# Altium project SPW-SPAI-ANODE-002D-SCH-FM.PrjPcb (part 3 of 3)

## Sheet PAGE12.SchDoc
size 246 x 182 mm
Used 11 times, as channels Array/CFD26, Array/CFD24, Array/CFD22, Array/CFD20, Array/CFD18, Array/CFD16, Array/CFD14, Array/CFD12, Array/CFD27, Array/CFD25, Array/CFD23. Parts and nets are listed once, with the designators drawn on the sheet.
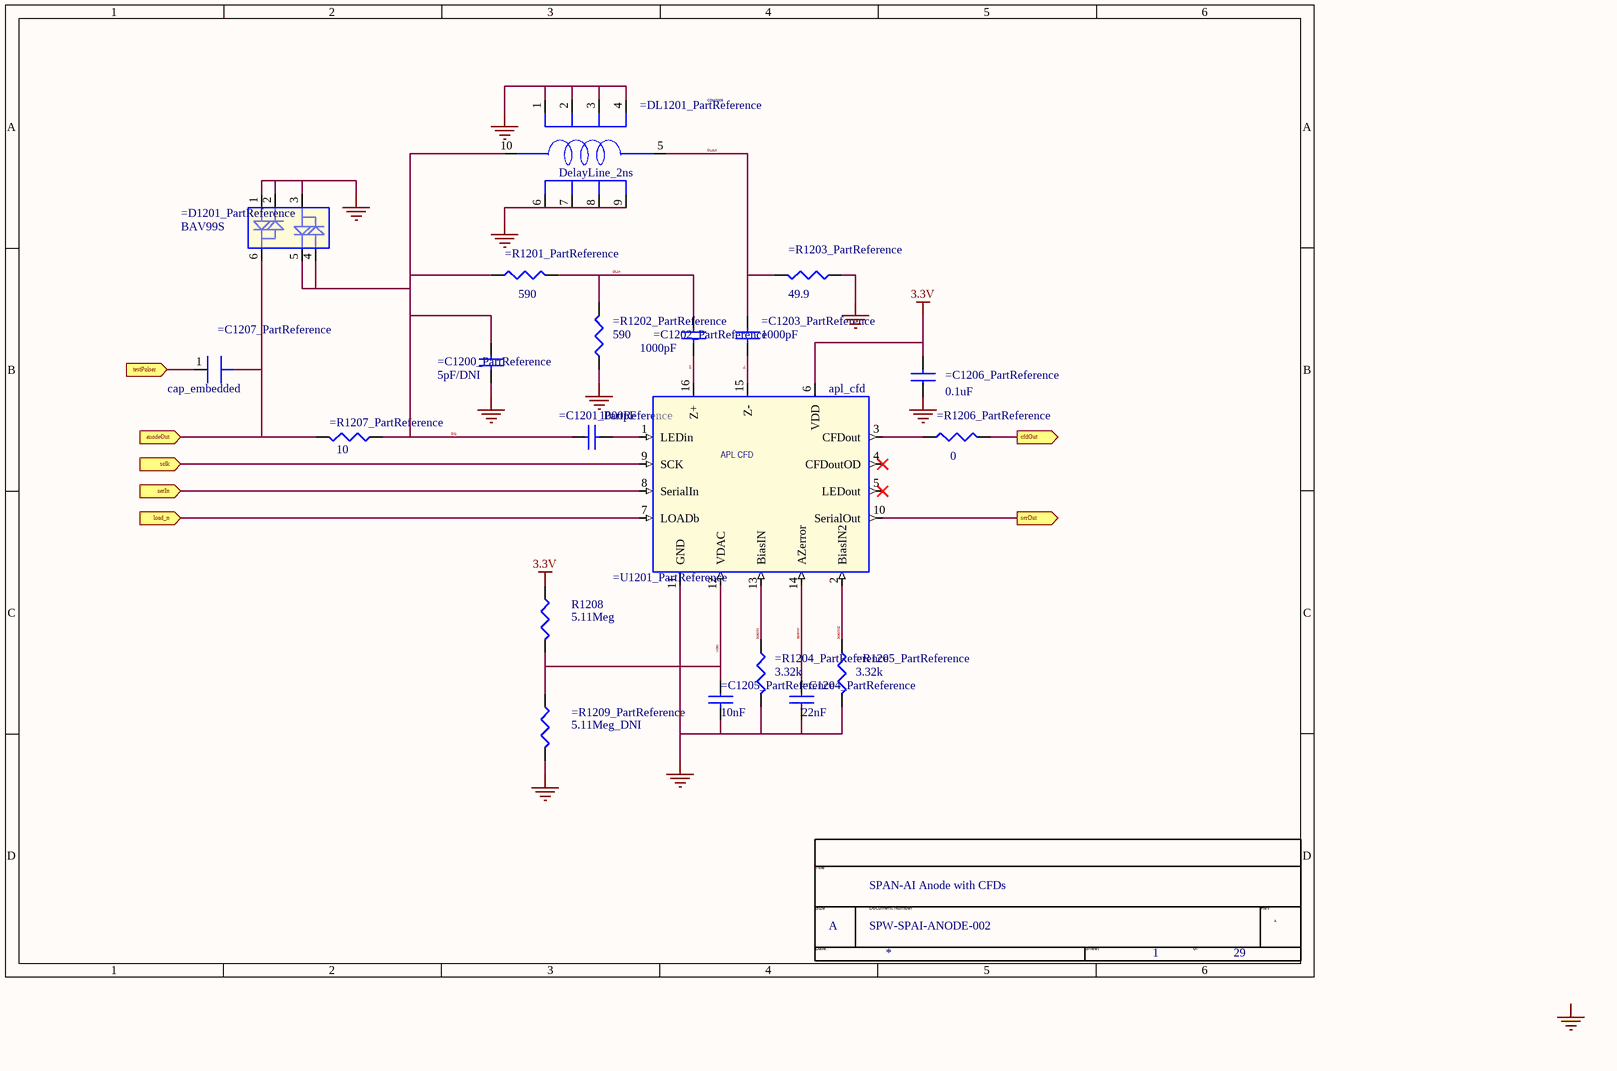
[diagram p15: PAGE12.SchDoc]

### Parts
*  Page Count: 29  Page Number: 1  Page Size: A  Title: SPAN-AI Anode with CFDs  Doc: SPW-SPAI-ANODE-002  (hidden comment: TitleBlock0)  (graphical)
=C1200_PartReference  5pF/DNI  [0402]
=C1201_PartReference  1000pF  [0402]
=C1202_PartReference  1000pF  [0402]
=C1203_PartReference  1000pF  [0402]
=C1204_PartReference  22nF  [0603]
=C1205_PartReference  10nF  [0603]
=C1206_PartReference  0.1uF  [0805]
=C1207_PartReference  cap_embedded  [cap_emb]
=D1201_PartReference  BAV99S  [sot23]
=DL1201_PartReference  DelayLine_2ns  PartNumber: CDM2005  [CDM10]
=R1201_PartReference  590  [0402]
=R1202_PartReference  590  [0402]
=R1203_PartReference  49.9  [0402]
=R1204_PartReference  3.32k  [0402]
=R1205_PartReference  3.32k  [0402]
=R1206_PartReference  0  [0402]
=R1207_PartReference  10  [0402]
=R1209_PartReference  5.11Meg_DNI  [0402]
=U1201_PartReference  apl_cfd  [lcc16]
R1208  5.11Meg  [0402]

### Ports
anodeOut (in), cfdOut (out), load_n (in), sclk (in), serIn (in), serOut (out), testPulser (in)

### Nets
3.3V: =C1206_PartReference.2 =U1201_PartReference.6(VDD) R1208.1
GND: =C1200_PartReference.2 =C1204_PartReference.2 =C1205_PartReference.2 =C1206_PartReference.1 =D1201_PartReference.1 =D1201_PartReference.2 =D1201_PartReference.3 =DL1201_PartReference.1(GND1) =DL1201_PartReference.2(GND2) =DL1201_PartReference.3(GND3) =DL1201_PartReference.4(GND4) =DL1201_PartReference.6(GND5) =DL1201_PartReference.7(GND6) =DL1201_PartReference.8(GND7) =DL1201_PartReference.9(GND8) =R1202_PartReference.1 =R1203_PartReference.1 =R1204_PartReference.2 =R1205_PartReference.2 =R1209_PartReference.2 =U1201_PartReference.11(GND)
anodeOut: =D1201_PartReference.6 =R1207_PartReference.2 ; port anodeOut
azerror: =C1204_PartReference.1 =U1201_PartReference.14(AZerror)
biasIN: =R1204_PartReference.1 =U1201_PartReference.13(BiasIN)
biasIN2: =R1205_PartReference.1 =U1201_PartReference.2(BiasIN2)
cfdOut: =R1206_PartReference.2 ; port cfdOut
DLin: =C1202_PartReference.1 =R1201_PartReference.2 =R1202_PartReference.2
DLout: =C1203_PartReference.1 =DL1201_PartReference.5(OUT) =R1203_PartReference.2
load_n: =U1201_PartReference.7(LOADb) ; port load_n
sclk: =U1201_PartReference.9(SCK) ; port sclk
serIn: =U1201_PartReference.8(SerialIn) ; port serIn
serOut: =U1201_PartReference.10(SerialOut) ; port serOut
Sig: =C1200_PartReference.1 =C1201_PartReference.1 =D1201_PartReference.4 =D1201_PartReference.5 =DL1201_PartReference.10(IN) =R1201_PartReference.1 =R1207_PartReference.1
testPulser: =C1207_PartReference.1 ; port testPulser
vdac: =C1205_PartReference.1 =R1209_PartReference.1 =U1201_PartReference.12(VDAC) R1208.2
z+: =C1202_PartReference.2 =U1201_PartReference.16(Z+)
z-: =C1203_PartReference.2 =U1201_PartReference.15(Z-)
Net=C1201_PartReference_2: =C1201_PartReference.2 =U1201_PartReference.1(LEDin)
Net=R1206_PartReference_1: =R1206_PartReference.1 =U1201_PartReference.3(CFDout)

Not connected (* = marked no-connect by the designer): =U1201_PartReference 4(CFDoutOD)* 5(LEDout)*

### Channels
Array/CFD26: designators end in _CFD26; ports anodeOut=anode26 cfdOut=stop14 load_n=load_n10 sclk=sclk6 serIn=serOut9 serOut=serOut26 testPulser=tp_stop2
Array/CFD24: designators end in _CFD24; ports anodeOut=anode24 cfdOut=stop12 load_n=load_n8 sclk=sclk5 serIn=serOut7 serOut=serOut24 testPulser=tp_stop1
Array/CFD22: designators end in _CFD22; ports anodeOut=anode22 cfdOut=stop10 load_n=load_n6 sclk=sclk4 serIn=serOut5 serOut=serOut22 testPulser=tp_stop3
Array/CFD20: designators end in _CFD20; ports anodeOut=anode20 cfdOut=stop8 load_n=load_n5 sclk=sclk3 serIn=serOut21 serOut=serOut20 testPulser=tp_stop1
Array/CFD18: designators end in _CFD18; ports anodeOut=anode18 cfdOut=stop6 load_n=load_n4 sclk=sclk2 serIn=serOut19 serOut=serOut18 testPulser=tp_stop3
Array/CFD16: designators end in _CFD16; ports anodeOut=anode16 cfdOut=stop4 load_n=load_n3 sclk=sclk2 serIn=serOut17 serOut=serOut16 testPulser=tp_stop1
Array/CFD14: designators end in _CFD14; ports anodeOut=anode14 cfdOut=stop2 load_n=load_n2 sclk=sclk1 serIn=serOut15 serOut=serOut14 testPulser=tp_stop3
Array/CFD12: designators end in _CFD12; ports anodeOut=anode12 cfdOut=stop0 load_n=load_n1 sclk=sclk1 serIn=serOut13 serOut=serOut12 testPulser=tp_stop1
Array/CFD27: designators end in _CFD27; ports anodeOut=anode27 cfdOut=stop15 load_n=load_n11 sclk=sclk6 serIn=serOut10 serOut=serOut27 testPulser=tp_stop4
Array/CFD25: designators end in _CFD25; ports anodeOut=anode25 cfdOut=stop13 load_n=load_n9 sclk=sclk5 serIn=serOut8 serOut=serOut25 testPulser=tp_stop3
Array/CFD23: designators end in _CFD23; ports anodeOut=anode23 cfdOut=stop11 load_n=load_n7 sclk=sclk4 serIn=serOut6 serOut=serOut23 testPulser=tp_stop4

### Notes on the sheet
- Labels drawn without touching a wire or pin: GND
- (in symbol apl_cfd_1) APL CFD
- (in symbol TitleBlock0) Title; Size; Document Number; Rev; Date:; Sheet; of

### Library data of the parts
=C1200_PartReference = CAP NP_Dup2: PartNumber: SR0402NPO5R0B3; PCB Footprint: 0402
=C1201_PartReference =C1202_PartReference =C1203_PartReference = CAP NP_Dup2: PartNumber: SR0402NPO102B3; PCB Footprint: 0402
=C1204_PartReference = CAP NP_Dup2: PartNumber: SR0603X7R223K2NT95#M123; PCB Footprint: 0603
=C1205_PartReference = CAP NP_Dup2: PartNumber: SR0603X7R103K2NT95#M123; PCB Footprint: 0603
=C1206_PartReference = CAP NP_Dup2: PartNumber: SR0805X7R104K2NT95#M123; PCB Footprint: 0805
=D1201_PartReference = dual_diode_0: PartNumber: BAV99S; PCB Footprint: BAV99S
=DL1201_PartReference = DelayLine_1: PCB Footprint: CDM2005
=R1201_PartReference =R1202_PartReference = R_Dup1: PartNumber: M55342H11B590DR; PCB Footprint: 0402
=R1203_PartReference = R_Dup1: PartNumber: M55342H11B49D9R; PCB Footprint: 0402
=R1204_PartReference =R1205_PartReference = R_Dup1: PartNumber: M55342H11B3E32R; PCB Footprint: 0402
=R1206_PartReference = R_Dup1: PCB Footprint: 0402
=R1207_PartReference = R_Dup1: PartNumber: M55342H11B10D0R; PCB Footprint: 0402
=R1209_PartReference R1208 = R: Pin Numbers Visible: True; Pin Names Visible: False; EDIForiginalOrigin: (pt 0 0); EDIFviewName: NORMAL; PCB Footprint: 0402
=U1201_PartReference = apl_cfd_1: PCB Footprint: apl_cfd
* = TitleBlock0: RevCode: A; Page Create Date: March  8, 1995; Page Modify Date: *; Page_Number: =TitleBlock_1_Page_Number
=C1207_PartReference = cap_embedded: PCB Footprint: cap_emb

## Nets that join several sheets
3.3V: PAGE1 (27 pins), Array/CFD17 (C1306_CFD17.2 R1308_CFD17.1 U1301_CFD17.6), Array/CFD3 (=C106_PartReference_CFD3.2 =R108_PartReference_CFD3.1 =U101_PartReference_CFD3.6), Array/CFD15 (C1306_CFD15.2 R1308_CFD15.1 U1301_CFD15.6), Array/CFD13 (C1306_CFD13.2 R1308_CFD13.1 U1301_CFD13.6), Array/CFD11 (=C106_PartReference_CFD11.2 =R108_PartReference_CFD11.1 =U101_PartReference_CFD11.6), Array/CFD1 (=C106_PartReference_CFD1.2 =R108_PartReference_CFD1.1 =U101_PartReference_CFD1.6), Array/CFD9 (=C106_PartReference_CFD9.2 =R108_PartReference_CFD9.1 =U101_PartReference_CFD9.6), Array/CFD26 (=C1206_PartReference_CFD26.2 =U1201_PartReference_CFD26.6 R1208_CFD26.1), Array/CFD24 (=C1206_PartReference_CFD24.2 =U1201_PartReference_CFD24.6 R1208_CFD24.1), Array/CFD7 (=C106_PartReference_CFD7.2 =R108_PartReference_CFD7.1 =U101_PartReference_CFD7.6), Array/CFD22 (=C1206_PartReference_CFD22.2 =U1201_PartReference_CFD22.6 R1208_CFD22.1), Array/CFD5 (=C106_PartReference_CFD5.2 =R108_PartReference_CFD5.1 =U101_PartReference_CFD5.6), Array/CFD20 (=C1206_PartReference_CFD20.2 =U1201_PartReference_CFD20.6 R1208_CFD20.1), Array/CFD18 (=C1206_PartReference_CFD18.2 =U1201_PartReference_CFD18.6 R1208_CFD18.1), Array/CFD16 (=C1206_PartReference_CFD16.2 =U1201_PartReference_CFD16.6 R1208_CFD16.1), Array/CFD14 (=C1206_PartReference_CFD14.2 =U1201_PartReference_CFD14.6 R1208_CFD14.1), Array/CFD12 (=C1206_PartReference_CFD12.2 =U1201_PartReference_CFD12.6 R1208_CFD12.1), Array/CFD10 (=C106_PartReference_CFD10.2 =R108_PartReference_CFD10.1 =U101_PartReference_CFD10.6), Array/CFD2 (=C106_PartReference_CFD2.2 =R108_PartReference_CFD2.1 =U101_PartReference_CFD2.6), Array/CFD27 (=C1206_PartReference_CFD27.2 =U1201_PartReference_CFD27.6 R1208_CFD27.1), Array/CFD25 (=C1206_PartReference_CFD25.2 =U1201_PartReference_CFD25.6 R1208_CFD25.1), Array/CFD8 (=C106_PartReference_CFD8.2 =R108_PartReference_CFD8.1 =U101_PartReference_CFD8.6), Array/CFD23 (=C1206_PartReference_CFD23.2 =U1201_PartReference_CFD23.6 R1208_CFD23.1), Array/CFD6 (=C106_PartReference_CFD6.2 =R108_PartReference_CFD6.1 =U101_PartReference_CFD6.6), Array/CFD21 (C1306_CFD21.2 R1308_CFD21.1 U1301_CFD21.6), Array/CFD4 (=C106_PartReference_CFD4.2 =R108_PartReference_CFD4.1 =U101_PartReference_CFD4.6), Array/CFD19 (C1306_CFD19.2 R1308_CFD19.1 U1301_CFD19.6)
GND: PAGE1 (49 pins), Array/CFD17 (21 pins), Array/CFD3 (21 pins), Array/CFD15 (21 pins), Array/CFD13 (21 pins), Array/CFD11 (21 pins), Array/CFD1 (21 pins), Array/CFD9 (21 pins), Array/CFD26 (21 pins), Array/CFD24 (21 pins), Array/CFD7 (21 pins), Array/CFD22 (21 pins), Array/CFD5 (21 pins), Array/CFD20 (21 pins), Array/CFD18 (21 pins), Array/CFD16 (21 pins), Array/CFD14 (21 pins), Array/CFD12 (21 pins), Array/CFD10 (21 pins), Array/CFD2 (21 pins), Array/CFD27 (21 pins), Array/CFD25 (21 pins), Array/CFD8 (21 pins), Array/CFD23 (21 pins), Array/CFD6 (21 pins), Array/CFD21 (21 pins), Array/CFD4 (21 pins), Array/CFD19 (21 pins)
anode1: PAGE14 (A1.1), Array/CFD1 (=D101_PartReference_CFD1.3 =R107_PartReference_CFD1.2)
anode2: PAGE14 (A2.1), Array/CFD2 (=D101_PartReference_CFD2.3 =R107_PartReference_CFD2.2)
anode3: PAGE14 (A3.1), Array/CFD3 (=D101_PartReference_CFD3.3 =R107_PartReference_CFD3.2)
anode4: PAGE14 (A4.1), Array/CFD4 (=D101_PartReference_CFD4.3 =R107_PartReference_CFD4.2)
anode5: PAGE14 (A5.1), Array/CFD5 (=D101_PartReference_CFD5.3 =R107_PartReference_CFD5.2)
anode6: PAGE14 (A6.1), Array/CFD6 (=D101_PartReference_CFD6.3 =R107_PartReference_CFD6.2)
anode7: PAGE14 (A7.1), Array/CFD7 (=D101_PartReference_CFD7.3 =R107_PartReference_CFD7.2)
anode8: PAGE14 (A8.1), Array/CFD8 (=D101_PartReference_CFD8.3 =R107_PartReference_CFD8.2)
anode9: PAGE14 (A9.1), Array/CFD9 (=D101_PartReference_CFD9.3 =R107_PartReference_CFD9.2)
anode10: PAGE14 (A10.1), Array/CFD10 (=D101_PartReference_CFD10.3 =R107_PartReference_CFD10.2)
anode11: PAGE14 (A11.1), Array/CFD11 (=D101_PartReference_CFD11.3 =R107_PartReference_CFD11.2)
anode12: PAGE14 (A12.1), Array/CFD12 (=D1201_PartReference_CFD12.6 =R1207_PartReference_CFD12.2)
anode13: PAGE14 (A13.1), Array/CFD13 (=D1301_PartReference_CFD13.4 =D1301_PartReference_CFD13.5 =R1307_PartReference_CFD13.2)
anode14: PAGE14 (A14.1), Array/CFD14 (=D1201_PartReference_CFD14.6 =R1207_PartReference_CFD14.2)
anode15: PAGE14 (A15.1), Array/CFD15 (=D1301_PartReference_CFD15.4 =D1301_PartReference_CFD15.5 =R1307_PartReference_CFD15.2)
anode16: PAGE14 (A16.1), Array/CFD16 (=D1201_PartReference_CFD16.6 =R1207_PartReference_CFD16.2)
anode17: PAGE14 (A17.1), Array/CFD17 (=D1301_PartReference_CFD17.4 =D1301_PartReference_CFD17.5 =R1307_PartReference_CFD17.2)
anode18: PAGE14 (A18.1), Array/CFD18 (=D1201_PartReference_CFD18.6 =R1207_PartReference_CFD18.2)
anode19: PAGE14 (A19.1), Array/CFD19 (=D1301_PartReference_CFD19.4 =D1301_PartReference_CFD19.5 =R1307_PartReference_CFD19.2)
anode20: PAGE14 (A20.1), Array/CFD20 (=D1201_PartReference_CFD20.6 =R1207_PartReference_CFD20.2)
anode21: PAGE14 (A21.1), Array/CFD21 (=D1301_PartReference_CFD21.4 =D1301_PartReference_CFD21.5 =R1307_PartReference_CFD21.2)
anode22: PAGE14 (A22.1), Array/CFD22 (=D1201_PartReference_CFD22.6 =R1207_PartReference_CFD22.2)
anode23: PAGE14 (A23.1), Array/CFD23 (=D1201_PartReference_CFD23.6 =R1207_PartReference_CFD23.2)
anode24: PAGE14 (A24.1), Array/CFD24 (=D1201_PartReference_CFD24.6 =R1207_PartReference_CFD24.2)
anode25: PAGE14 (A25.1), Array/CFD25 (=D1201_PartReference_CFD25.6 =R1207_PartReference_CFD25.2)
anode26: PAGE14 (A26.1), Array/CFD26 (=D1201_PartReference_CFD26.6 =R1207_PartReference_CFD26.2)
anode27: PAGE14 (A27.1), Array/CFD27 (=D1201_PartReference_CFD27.6 =R1207_PartReference_CFD27.2)
load_n1: Array/CFD13 (U1301_CFD13.7), Array/CFD1 (=U101_PartReference_CFD1.7), Array/CFD12 (=U1201_PartReference_CFD12.7)
load_n2: Array/CFD15 (U1301_CFD15.7), Array/CFD14 (=U1201_PartReference_CFD14.7), Array/CFD2 (=U101_PartReference_CFD2.7)
load_n3: Array/CFD17 (U1301_CFD17.7), Array/CFD3 (=U101_PartReference_CFD3.7), Array/CFD16 (=U1201_PartReference_CFD16.7)
load_n4: Array/CFD18 (=U1201_PartReference_CFD18.7), Array/CFD4 (=U101_PartReference_CFD4.7), Array/CFD19 (U1301_CFD19.7)
load_n5: Array/CFD5 (=U101_PartReference_CFD5.7), Array/CFD20 (=U1201_PartReference_CFD20.7), Array/CFD21 (U1301_CFD21.7)
load_n6: Array/CFD22 (=U1201_PartReference_CFD22.7), Array/CFD6 (=U101_PartReference_CFD6.7)
load_n7: Array/CFD7 (=U101_PartReference_CFD7.7), Array/CFD23 (=U1201_PartReference_CFD23.7)
load_n8: Array/CFD24 (=U1201_PartReference_CFD24.7), Array/CFD8 (=U101_PartReference_CFD8.7)
load_n9: Array/CFD9 (=U101_PartReference_CFD9.7), Array/CFD25 (=U1201_PartReference_CFD25.7)
load_n10: Array/CFD26 (=U1201_PartReference_CFD26.7), Array/CFD10 (=U101_PartReference_CFD10.7)
load_n11: Array/CFD11 (=U101_PartReference_CFD11.7), Array/CFD27 (=U1201_PartReference_CFD27.7)
sclk1: Array/CFD15 (U1301_CFD15.9), Array/CFD13 (U1301_CFD13.9), Array/CFD1 (=U101_PartReference_CFD1.9), Array/CFD14 (=U1201_PartReference_CFD14.9), Array/CFD12 (=U1201_PartReference_CFD12.9), Array/CFD2 (=U101_PartReference_CFD2.9)
sclk2: Array/CFD17 (U1301_CFD17.9), Array/CFD3 (=U101_PartReference_CFD3.9), Array/CFD18 (=U1201_PartReference_CFD18.9), Array/CFD16 (=U1201_PartReference_CFD16.9), Array/CFD4 (=U101_PartReference_CFD4.9), Array/CFD19 (U1301_CFD19.9)
sclk3: Array/CFD5 (=U101_PartReference_CFD5.9), Array/CFD20 (=U1201_PartReference_CFD20.9), Array/CFD21 (U1301_CFD21.9)
sclk4: Array/CFD7 (=U101_PartReference_CFD7.9), Array/CFD22 (=U1201_PartReference_CFD22.9), Array/CFD23 (=U1201_PartReference_CFD23.9), Array/CFD6 (=U101_PartReference_CFD6.9)
sclk5: Array/CFD9 (=U101_PartReference_CFD9.9), Array/CFD24 (=U1201_PartReference_CFD24.9), Array/CFD25 (=U1201_PartReference_CFD25.9), Array/CFD8 (=U101_PartReference_CFD8.9)
sclk6: Array/CFD11 (=U101_PartReference_CFD11.9), Array/CFD26 (=U1201_PartReference_CFD26.9), Array/CFD10 (=U101_PartReference_CFD10.9), Array/CFD27 (=U1201_PartReference_CFD27.9)
serOut1: Array/CFD15 (U1301_CFD15.8), Array/CFD1 (=U101_PartReference_CFD1.10)
serOut2: Array/CFD17 (U1301_CFD17.8), Array/CFD2 (=U101_PartReference_CFD2.10)
serOut3: Array/CFD3 (=U101_PartReference_CFD3.10), Array/CFD19 (U1301_CFD19.8)
serOut4: Array/CFD21 (U1301_CFD21.8), Array/CFD4 (=U101_PartReference_CFD4.10)
serOut5: Array/CFD22 (=U1201_PartReference_CFD22.8), Array/CFD5 (=U101_PartReference_CFD5.10)
serOut6: Array/CFD23 (=U1201_PartReference_CFD23.8), Array/CFD6 (=U101_PartReference_CFD6.10)
serOut7: Array/CFD24 (=U1201_PartReference_CFD24.8), Array/CFD7 (=U101_PartReference_CFD7.10)
serOut8: Array/CFD25 (=U1201_PartReference_CFD25.8), Array/CFD8 (=U101_PartReference_CFD8.10)
serOut9: Array/CFD9 (=U101_PartReference_CFD9.10), Array/CFD26 (=U1201_PartReference_CFD26.8)
serOut10: Array/CFD10 (=U101_PartReference_CFD10.10), Array/CFD27 (=U1201_PartReference_CFD27.8)
serOut11: PAGE1 (J1.43), Array/CFD11 (=U101_PartReference_CFD11.10)
serOut12: Array/CFD1 (=U101_PartReference_CFD1.8), Array/CFD12 (=U1201_PartReference_CFD12.10)
serOut13: Array/CFD13 (U1301_CFD13.10), Array/CFD12 (=U1201_PartReference_CFD12.8)
serOut14: Array/CFD14 (=U1201_PartReference_CFD14.10), Array/CFD2 (=U101_PartReference_CFD2.8)
serOut15: Array/CFD15 (U1301_CFD15.10), Array/CFD14 (=U1201_PartReference_CFD14.8)
serOut16: Array/CFD3 (=U101_PartReference_CFD3.8), Array/CFD16 (=U1201_PartReference_CFD16.10)
serOut17: Array/CFD17 (U1301_CFD17.10), Array/CFD16 (=U1201_PartReference_CFD16.8)
serOut18: Array/CFD18 (=U1201_PartReference_CFD18.10), Array/CFD4 (=U101_PartReference_CFD4.8)
serOut19: Array/CFD18 (=U1201_PartReference_CFD18.8), Array/CFD19 (U1301_CFD19.10)
serOut20: Array/CFD5 (=U101_PartReference_CFD5.8), Array/CFD20 (=U1201_PartReference_CFD20.10)
serOut21: Array/CFD20 (=U1201_PartReference_CFD20.8), Array/CFD21 (U1301_CFD21.10)
serOut22: Array/CFD22 (=U1201_PartReference_CFD22.10), Array/CFD6 (=U101_PartReference_CFD6.8)
serOut23: Array/CFD7 (=U101_PartReference_CFD7.8), Array/CFD23 (=U1201_PartReference_CFD23.10)
serOut24: Array/CFD24 (=U1201_PartReference_CFD24.10), Array/CFD8 (=U101_PartReference_CFD8.8)
serOut25: Array/CFD9 (=U101_PartReference_CFD9.8), Array/CFD25 (=U1201_PartReference_CFD25.10)
serOut26: Array/CFD26 (=U1201_PartReference_CFD26.10), Array/CFD10 (=U101_PartReference_CFD10.8)
serOut27: Array/CFD11 (=U101_PartReference_CFD11.8), Array/CFD27 (=U1201_PartReference_CFD27.10)
start0: PAGE1 (J1.3), Array/CFD1 (=R106_PartReference_CFD1.2)
start2: PAGE1 (J1.6), Array/CFD2 (=R106_PartReference_CFD2.2)
start4: PAGE1 (J1.9), Array/CFD3 (=R106_PartReference_CFD3.2)
start6: PAGE1 (J1.12), Array/CFD4 (=R106_PartReference_CFD4.2)
start8: PAGE1 (J1.58), Array/CFD5 (=R106_PartReference_CFD5.2)
start10: PAGE1 (J1.56), Array/CFD6 (=R106_PartReference_CFD6.2)
start11: PAGE1 (J1.54), Array/CFD7 (=R106_PartReference_CFD7.2)
start12: PAGE1 (J1.52), Array/CFD8 (=R106_PartReference_CFD8.2)
start13: PAGE1 (J1.50), Array/CFD9 (=R106_PartReference_CFD9.2)
start14: PAGE1 (J1.48), Array/CFD10 (=R106_PartReference_CFD10.2)
start15: PAGE1 (J1.46), Array/CFD11 (=R106_PartReference_CFD11.2)
stop0: PAGE1 (J1.1), Array/CFD12 (=R1206_PartReference_CFD12.2)
stop1: PAGE1 (J1.2), Array/CFD13 (R1306_CFD13.2)
stop2: PAGE1 (J1.4), Array/CFD14 (=R1206_PartReference_CFD14.2)
stop3: PAGE1 (J1.5), Array/CFD15 (R1306_CFD15.2)
stop4: PAGE1 (J1.7), Array/CFD16 (=R1206_PartReference_CFD16.2)
stop5: PAGE1 (J1.8), Array/CFD17 (R1306_CFD17.2)
stop6: PAGE1 (J1.10), Array/CFD18 (=R1206_PartReference_CFD18.2)
stop7: PAGE1 (J1.11), Array/CFD19 (R1306_CFD19.2)
stop8: PAGE1 (J1.13), Array/CFD20 (=R1206_PartReference_CFD20.2)
stop9: PAGE1 (J1.14), Array/CFD21 (R1306_CFD21.2)
stop10: PAGE1 (J1.57), Array/CFD22 (=R1206_PartReference_CFD22.2)
stop11: PAGE1 (J1.55), Array/CFD23 (=R1206_PartReference_CFD23.2)
stop12: PAGE1 (J1.53), Array/CFD24 (=R1206_PartReference_CFD24.2)
stop13: PAGE1 (J1.51), Array/CFD25 (=R1206_PartReference_CFD25.2)
stop14: PAGE1 (J1.49), Array/CFD26 (=R1206_PartReference_CFD26.2)
stop15: PAGE1 (J1.47), Array/CFD27 (=R1206_PartReference_CFD27.2)
tp_start1: Array/CFD11 (=C107_PartReference_CFD11.1), Array/CFD1 (=C107_PartReference_CFD1.1), Array/CFD4 (=C107_PartReference_CFD4.1)
tp_start2: Array/CFD2 (=C107_PartReference_CFD2.1), Array/CFD6 (=C107_PartReference_CFD6.1)
tp_start3: Array/CFD3 (=C107_PartReference_CFD3.1), Array/CFD9 (=C107_PartReference_CFD9.1), Array/CFD7 (=C107_PartReference_CFD7.1)
tp_start4: Array/CFD5 (=C107_PartReference_CFD5.1), Array/CFD10 (=C107_PartReference_CFD10.1), Array/CFD8 (=C107_PartReference_CFD8.1)
tp_stop1: Array/CFD24 (=C1207_PartReference_CFD24.1), Array/CFD20 (=C1207_PartReference_CFD20.1), Array/CFD16 (=C1207_PartReference_CFD16.1), Array/CFD12 (=C1207_PartReference_CFD12.1)
tp_stop2: Array/CFD17 (C1307_CFD17.1), Array/CFD13 (C1307_CFD13.1), Array/CFD26 (=C1207_PartReference_CFD26.1), Array/CFD21 (C1307_CFD21.1)
tp_stop3: Array/CFD22 (=C1207_PartReference_CFD22.1), Array/CFD18 (=C1207_PartReference_CFD18.1), Array/CFD14 (=C1207_PartReference_CFD14.1), Array/CFD25 (=C1207_PartReference_CFD25.1)
tp_stop4: Array/CFD15 (C1307_CFD15.1), Array/CFD27 (=C1207_PartReference_CFD27.1), Array/CFD23 (=C1207_PartReference_CFD23.1), Array/CFD19 (C1307_CFD19.1)